# Altium project PSLink_v2.PrjPcb (part 1 of 2)
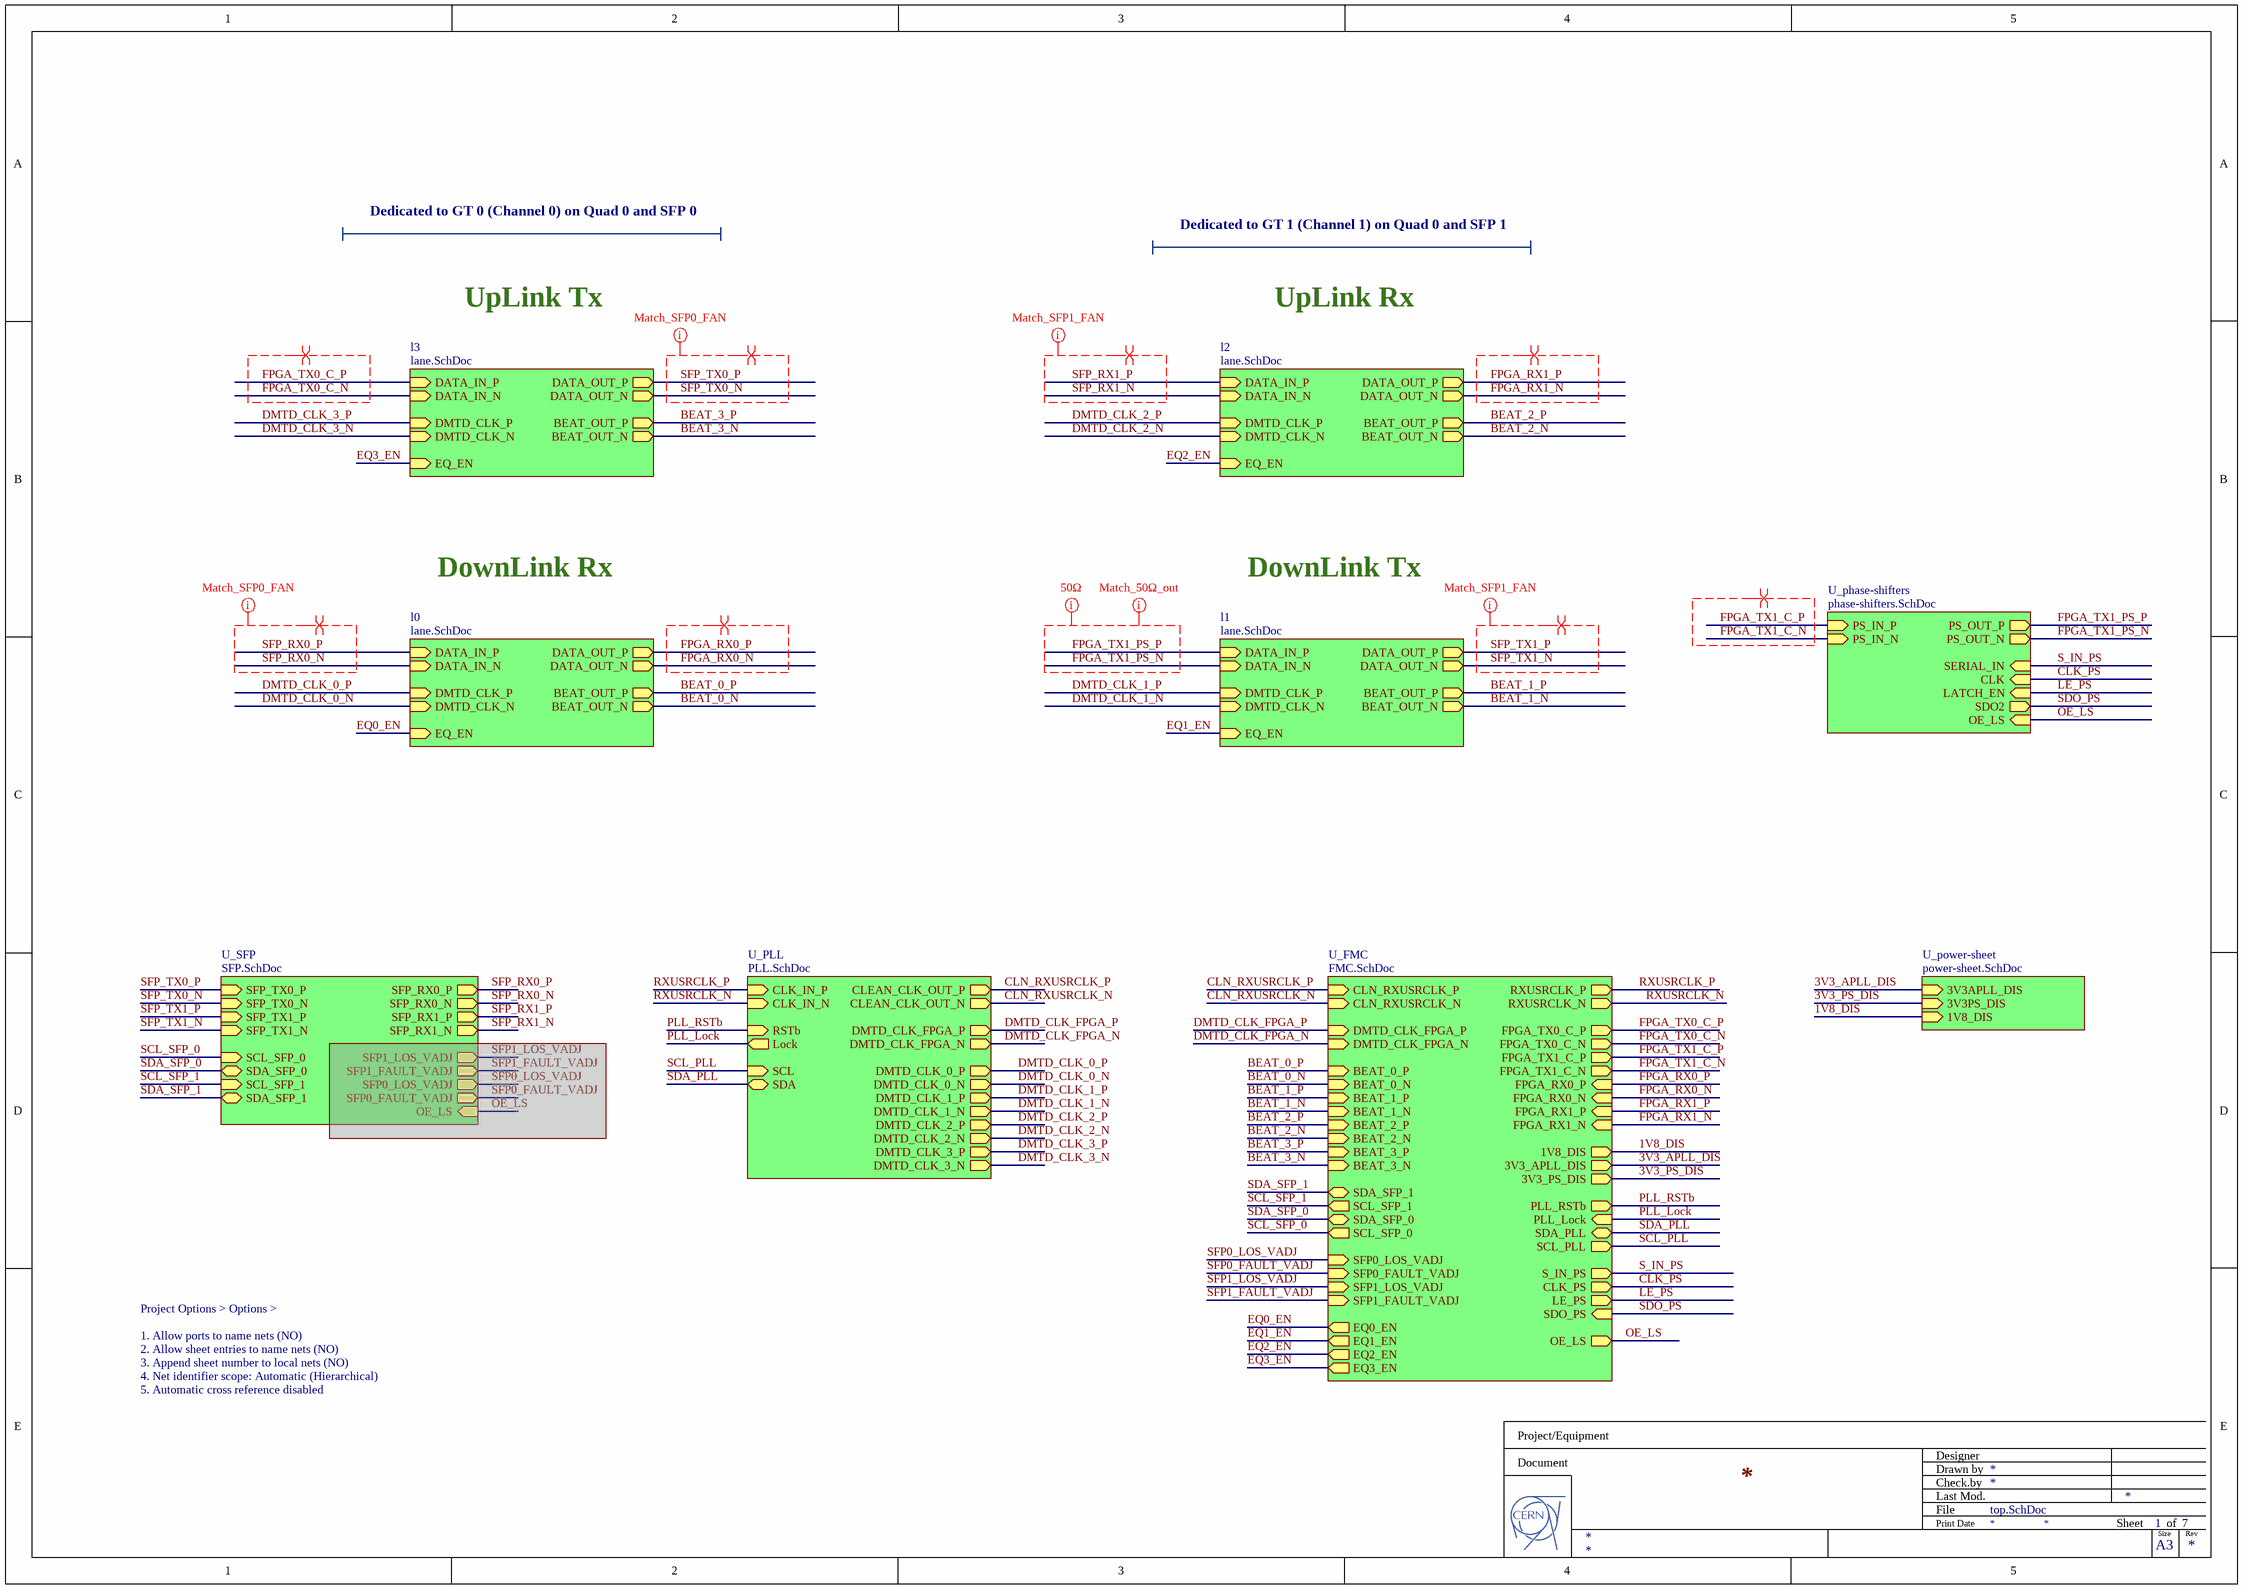
[diagram p0: top.SchDoc]
Board_Revision: 1.0
7 sheets, 294 parts. Net scope: hierarchical (ports join the sheet entries above them; power ports are global).
Board file: PCB.PcbDoc
Sheets:
  top.SchDoc
    U_SFP = SFP.SchDoc
    U_PLL = PLL.SchDoc
    l3 = lane.SchDoc
    l2 = lane.SchDoc
    l1 = lane.SchDoc
    l0 = lane.SchDoc
    U_power-sheet = power-sheet.SchDoc
    U_FMC = FMC.SchDoc
    U_phase-shifters = phase-shifters.SchDoc

## Sheet top.SchDoc
size 420 x 297 mm; SheetNumber: 1; SheetTotal: 7

### Sub-sheets
l0 = lane.SchDoc: DATA_IN_P (in), DATA_IN_N (in), BEAT_OUT_P (out), BEAT_OUT_N (out), DMTD_CLK_P (in), DMTD_CLK_N (in), DATA_OUT_P (out), DATA_OUT_N (out), EQ_EN (in)
l1 = lane.SchDoc: DATA_IN_P (in), DATA_IN_N (in), BEAT_OUT_P (out), BEAT_OUT_N (out), DMTD_CLK_P (in), DMTD_CLK_N (in), DATA_OUT_P (out), DATA_OUT_N (out), EQ_EN (in)
l2 = lane.SchDoc: DATA_IN_P (in), DATA_IN_N (in), BEAT_OUT_P (out), BEAT_OUT_N (out), DMTD_CLK_P (in), DMTD_CLK_N (in), DATA_OUT_P (out), DATA_OUT_N (out), EQ_EN (in)
l3 = lane.SchDoc: DATA_IN_P (in), DATA_IN_N (in), BEAT_OUT_P (out), BEAT_OUT_N (out), DMTD_CLK_P (in), DMTD_CLK_N (in), DATA_OUT_P (out), DATA_OUT_N (out), EQ_EN (in)
U_FMC = FMC.SchDoc: DMTD_CLK_FPGA_N (in), DMTD_CLK_FPGA_P (in), BEAT_3_P (in), BEAT_3_N (in), SCL_PLL (out), SDA_PLL (bidir), SCL_SFP_1 (out), SDA_SFP_1 (bidir), SCL_SFP_0 (out), SDA_SFP_0 (bidir), PLL_Lock (in), SFP0_LOS_VADJ (in), SFP0_FAULT_VADJ (in), SFP1_LOS_VADJ (in), SFP1_FAULT_VADJ (in), CLN_RXUSRCLK_P (in), CLN_RXUSRCLK_N (in), RXUSRCLK_P (out), RXUSRCLK_N (out), PLL_RSTb (out), 1V8_DIS (out), 3V3_APLL_DIS (out), 3V3_PS_DIS (out), FPGA_TX0_C_P (out), FPGA_TX0_C_N (out), FPGA_TX1_C_P (out), FPGA_TX1_C_N (out), FPGA_RX0_P (in), FPGA_RX0_N (in), FPGA_RX1_P (in), FPGA_RX1_N (in), BEAT_0_P (in), BEAT_0_N (in), BEAT_1_P (in), BEAT_1_N (in), BEAT_2_P (in), BEAT_2_N (in), S_IN_PS (out), CLK_PS (out), LE_PS (out), SDO_PS (in), EQ0_EN (out), EQ1_EN (out), EQ2_EN (out), EQ3_EN (out), OE_LS (out)
U_phase-shifters = phase-shifters.SchDoc: PS_IN_P (in), PS_IN_N (in), PS_OUT_P (out), LATCH_EN (in), CLK (in), SERIAL_IN (in), SDO2 (out), PS_OUT_N (out), OE_LS (in)
U_PLL = PLL.SchDoc: SCL (in), SDA (bidir), CLK_IN_P (in), CLK_IN_N (in), CLEAN_CLK_OUT_P (out), CLEAN_CLK_OUT_N (out), DMTD_CLK_0_P (out), DMTD_CLK_0_N (out), DMTD_CLK_1_P (out), DMTD_CLK_1_N (out), DMTD_CLK_2_P (out), DMTD_CLK_2_N (out), DMTD_CLK_FPGA_P (out), DMTD_CLK_FPGA_N (out), DMTD_CLK_3_P (out), DMTD_CLK_3_N (out), Lock (out), RSTb (in)
U_power-sheet = power-sheet.SchDoc: 3V3APLL_DIS (in), 3V3PS_DIS (in), 1V8_DIS (in)
U_SFP = SFP.SchDoc: SFP_RX0_P (out), SFP_RX0_N (out), SFP_TX0_P (in), SFP_TX0_N (in), SFP_RX1_P (out), SFP_RX1_N (out), SFP_TX1_P (in), SFP_TX1_N (in), SCL_SFP_0 (in), SDA_SFP_0 (bidir), SCL_SFP_1 (in), SDA_SFP_1 (bidir), SFP1_LOS_VADJ (out), SFP1_FAULT_VADJ (out), SFP0_LOS_VADJ (out), SFP0_FAULT_VADJ (out), OE_LS (in)

### Nets
1V8_DIS: sheet U_power-sheet/1V8_DIS, sheet U_FMC/1V8_DIS
3V3_APLL_DIS: sheet U_power-sheet/3V3APLL_DIS, sheet U_FMC/3V3_APLL_DIS
3V3_PS_DIS: sheet U_power-sheet/3V3PS_DIS, sheet U_FMC/3V3_PS_DIS
BEAT_0_N: sheet l0/BEAT_OUT_N, sheet U_FMC/BEAT_0_N
BEAT_0_P: sheet l0/BEAT_OUT_P, sheet U_FMC/BEAT_0_P
BEAT_1_N: sheet l1/BEAT_OUT_N, sheet U_FMC/BEAT_1_N
BEAT_1_P: sheet l1/BEAT_OUT_P, sheet U_FMC/BEAT_1_P
BEAT_2_N: sheet l2/BEAT_OUT_N, sheet U_FMC/BEAT_2_N
BEAT_2_P: sheet l2/BEAT_OUT_P, sheet U_FMC/BEAT_2_P
BEAT_3_N: sheet l3/BEAT_OUT_N, sheet U_FMC/BEAT_3_N
BEAT_3_P: sheet l3/BEAT_OUT_P, sheet U_FMC/BEAT_3_P
CLK_PS: sheet U_FMC/CLK_PS, sheet U_phase-shifters/CLK
CLN_RXUSRCLK_N: sheet U_PLL/CLEAN_CLK_OUT_N, sheet U_FMC/CLN_RXUSRCLK_N
CLN_RXUSRCLK_P: sheet U_PLL/CLEAN_CLK_OUT_P, sheet U_FMC/CLN_RXUSRCLK_P
DMTD_CLK_0_N: sheet U_PLL/DMTD_CLK_0_N, sheet l0/DMTD_CLK_N
DMTD_CLK_0_P: sheet U_PLL/DMTD_CLK_0_P, sheet l0/DMTD_CLK_P
DMTD_CLK_1_N: sheet U_PLL/DMTD_CLK_1_N, sheet l1/DMTD_CLK_N
DMTD_CLK_1_P: sheet U_PLL/DMTD_CLK_1_P, sheet l1/DMTD_CLK_P
DMTD_CLK_2_N: sheet U_PLL/DMTD_CLK_2_N, sheet l2/DMTD_CLK_N
DMTD_CLK_2_P: sheet U_PLL/DMTD_CLK_2_P, sheet l2/DMTD_CLK_P
DMTD_CLK_3_N: sheet U_PLL/DMTD_CLK_3_N, sheet l3/DMTD_CLK_N
DMTD_CLK_3_P: sheet U_PLL/DMTD_CLK_3_P, sheet l3/DMTD_CLK_P
DMTD_CLK_FPGA_N: sheet U_PLL/DMTD_CLK_FPGA_N, sheet U_FMC/DMTD_CLK_FPGA_N
DMTD_CLK_FPGA_P: sheet U_PLL/DMTD_CLK_FPGA_P, sheet U_FMC/DMTD_CLK_FPGA_P
EQ0_EN: sheet l0/EQ_EN, sheet U_FMC/EQ0_EN
EQ1_EN: sheet l1/EQ_EN, sheet U_FMC/EQ1_EN
EQ2_EN: sheet l2/EQ_EN, sheet U_FMC/EQ2_EN
EQ3_EN: sheet l3/EQ_EN, sheet U_FMC/EQ3_EN
FPGA_RX0_N: sheet l0/DATA_OUT_N, sheet U_FMC/FPGA_RX0_N
FPGA_RX0_P: sheet l0/DATA_OUT_P, sheet U_FMC/FPGA_RX0_P
FPGA_RX1_N: sheet l2/DATA_OUT_N, sheet U_FMC/FPGA_RX1_N
FPGA_RX1_P: sheet l2/DATA_OUT_P, sheet U_FMC/FPGA_RX1_P
FPGA_TX0_C_N: sheet l3/DATA_IN_N, sheet U_FMC/FPGA_TX0_C_N
FPGA_TX0_C_P: sheet l3/DATA_IN_P, sheet U_FMC/FPGA_TX0_C_P
FPGA_TX1_C_N: sheet U_FMC/FPGA_TX1_C_N, sheet U_phase-shifters/PS_IN_N
FPGA_TX1_C_P: sheet U_FMC/FPGA_TX1_C_P, sheet U_phase-shifters/PS_IN_P
FPGA_TX1_PS_N: sheet l1/DATA_IN_N, sheet U_phase-shifters/PS_OUT_N
FPGA_TX1_PS_P: sheet l1/DATA_IN_P, sheet U_phase-shifters/PS_OUT_P
LE_PS: sheet U_FMC/LE_PS, sheet U_phase-shifters/LATCH_EN
OE_LS: sheet U_FMC/OE_LS, sheet U_phase-shifters/OE_LS
PLL_Lock: sheet U_PLL/Lock, sheet U_FMC/PLL_Lock
PLL_RSTb: sheet U_PLL/RSTb, sheet U_FMC/PLL_RSTb
RXUSRCLK_N: sheet U_PLL/CLK_IN_N, sheet U_FMC/RXUSRCLK_N
RXUSRCLK_P: sheet U_PLL/CLK_IN_P, sheet U_FMC/RXUSRCLK_P
S_IN_PS: sheet U_FMC/S_IN_PS, sheet U_phase-shifters/SERIAL_IN
SCL_PLL: sheet U_PLL/SCL, sheet U_FMC/SCL_PLL  [project net ADJ_SCL]
SCL_SFP_0: sheet U_SFP/SCL_SFP_0, sheet U_FMC/SCL_SFP_0  [project net SCL0]
SCL_SFP_1: sheet U_SFP/SCL_SFP_1, sheet U_FMC/SCL_SFP_1  [project net SCL1]
SDA_PLL: sheet U_PLL/SDA, sheet U_FMC/SDA_PLL  [project net ADJ_SDA]
SDA_SFP_0: sheet U_SFP/SDA_SFP_0, sheet U_FMC/SDA_SFP_0  [project net SDA0]
SDA_SFP_1: sheet U_SFP/SDA_SFP_1, sheet U_FMC/SDA_SFP_1  [project net SDA1]
SDO_PS: sheet U_FMC/SDO_PS, sheet U_phase-shifters/SDO2
SFP0_FAULT_VADJ: sheet U_FMC/SFP0_FAULT_VADJ
SFP0_LOS_VADJ: sheet U_FMC/SFP0_LOS_VADJ
SFP1_FAULT_VADJ: sheet U_FMC/SFP1_FAULT_VADJ
SFP1_LOS_VADJ: sheet U_FMC/SFP1_LOS_VADJ
SFP_RX0_N: sheet U_SFP/SFP_RX0_N, sheet l0/DATA_IN_N
SFP_RX0_P: sheet U_SFP/SFP_RX0_P, sheet l0/DATA_IN_P
SFP_RX1_N: sheet U_SFP/SFP_RX1_N, sheet l2/DATA_IN_N
SFP_RX1_P: sheet U_SFP/SFP_RX1_P, sheet l2/DATA_IN_P
SFP_TX0_N: sheet U_SFP/SFP_TX0_N, sheet l3/DATA_OUT_N
SFP_TX0_P: sheet U_SFP/SFP_TX0_P, sheet l3/DATA_OUT_P
SFP_TX1_N: sheet U_SFP/SFP_TX1_N, sheet l1/DATA_OUT_N
SFP_TX1_P: sheet U_SFP/SFP_TX1_P, sheet l1/DATA_OUT_P

### Layout directives
differential pair: FPGA_RX0_N, FPGA_RX0_P, FPGA_RX1_N, FPGA_RX1_P, FPGA_TX0_C_N, FPGA_TX0_C_P, FPGA_TX1_C_N, FPGA_TX1_C_P, SFP_RX0_N, SFP_RX0_P, SFP_RX1_N, SFP_RX1_P, SFP_TX0_N, SFP_TX0_P, SFP_TX1_N, SFP_TX1_P
net class Match_SFP0_FAN: SFP_RX0_N, SFP_RX0_P, SFP_TX0_N, SFP_TX0_P
net class Match_SFP1_FAN: SFP_RX1_N, SFP_RX1_P, SFP_TX1_N, SFP_TX1_P
net class Match_50ohm_out: FPGA_TX1_PS_N, FPGA_TX1_PS_P
net class 50ohm: FPGA_TX1_PS_N, FPGA_TX1_PS_P

### Notes on the sheet
- Dedicated to GT 0 (Channel 0) on Quad 0 and SFP 0
- Dedicated to GT 1 (Channel 1) on Quad 0 and SFP 1
- UpLink Tx
- UpLink Rx
- DownLink Rx
- DownLink Tx
- Project Options > Options >
  1. Allow ports to name nets (NO)
  2. Allow sheet entries to name nets (NO)
  3. Append sheet number to local nets (NO)
  4. Net identifier scope: Automatic (Hierarchical)
  5. Automatic cross reference disabled
- Project/Equipment
- Document
- Designer
- Drawn by
- Check.by
- File
- Last Mod.
- Print Date
- Sheet
- Size
- A3
- of
- Rev

## Sheet SFP.SchDoc
size 420 x 297 mm; SheetNumber: 3; SheetTotal: 7
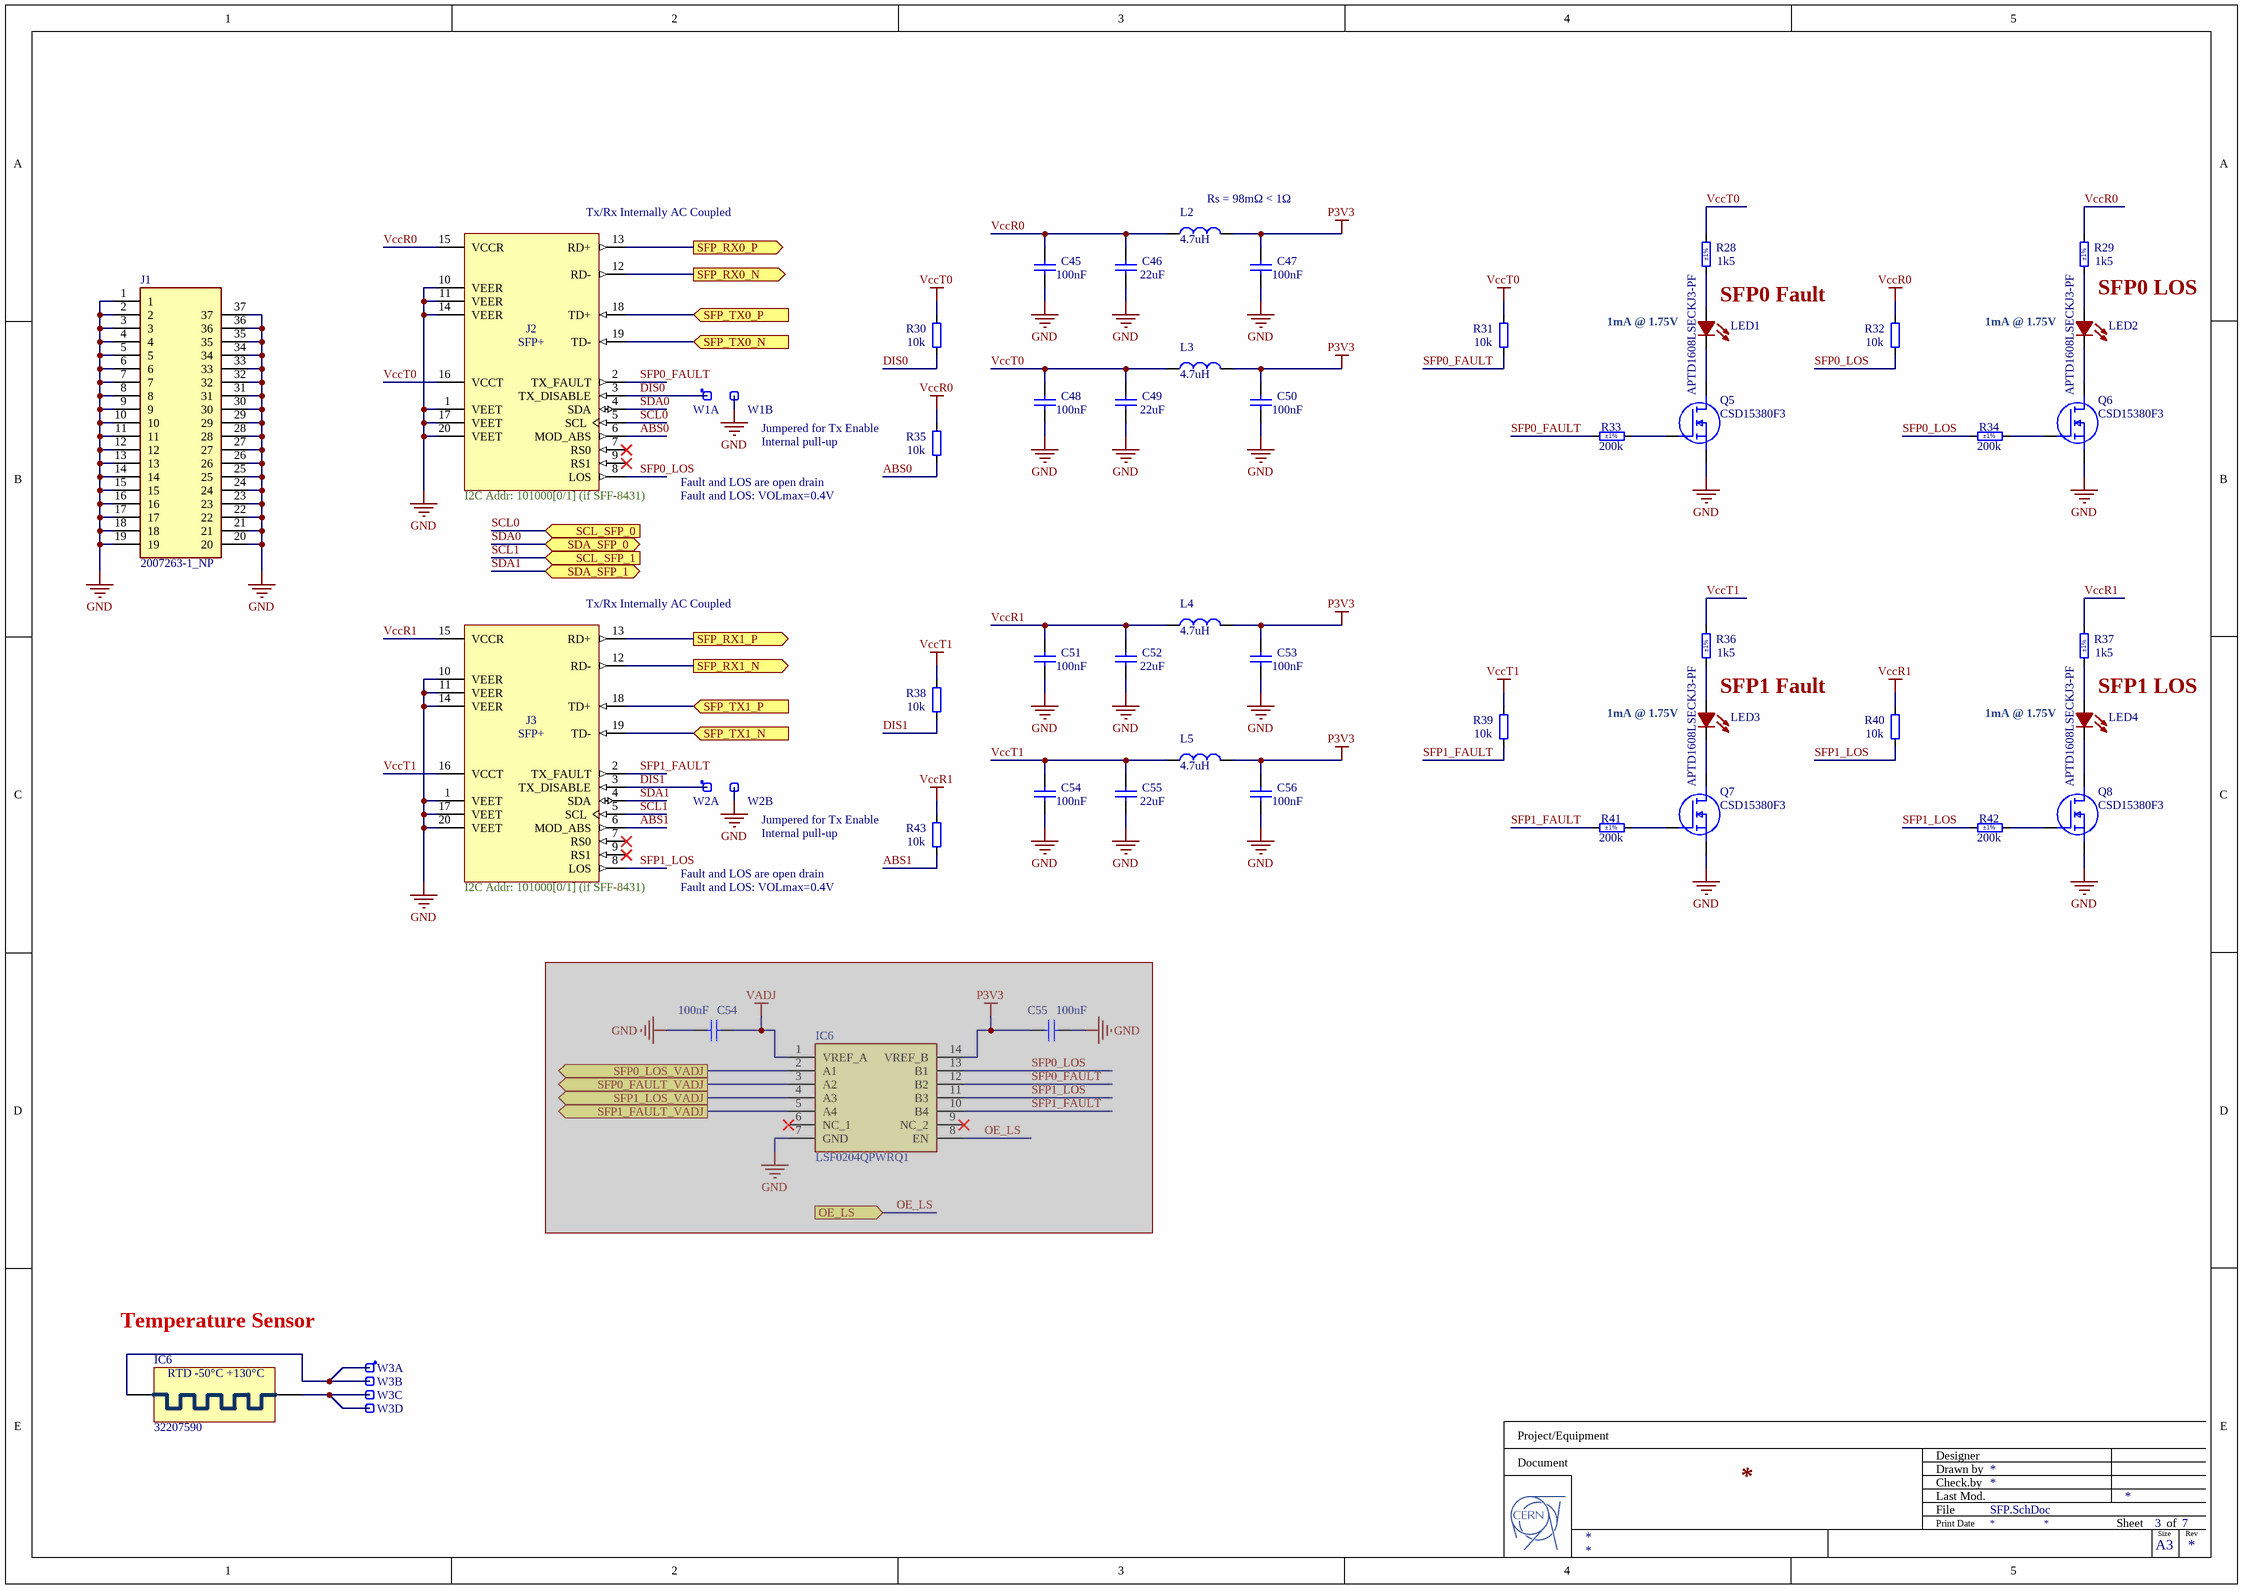
[diagram p1: SFP.SchDoc]

### Parts
(Parts that share a designator on the sheet are numbered #1, #2 ... from top to bottom, then left to right.)
C45  100nF  [MURATA_HI_DENSITY_0201]
C46  22uF  [MURATA_HI_DENSITY_0402_CAP]
C47  100nF  [MURATA_HI_DENSITY_0201]
C48  100nF  [MURATA_HI_DENSITY_0201]
C49  22uF  [MURATA_HI_DENSITY_0402_CAP]
C50  100nF  [MURATA_HI_DENSITY_0201]
C51  100nF  [MURATA_HI_DENSITY_0201]
C52  22uF  [MURATA_HI_DENSITY_0402_CAP]
C53  100nF  [MURATA_HI_DENSITY_0201]
C54#1  100nF  [MURATA_HI_DENSITY_0201]
C54#2  100nF  [MURATA_HI_DENSITY_0201]  (masked out: inside a compile mask, not in the netlist)
C55#1  22uF  [MURATA_HI_DENSITY_0402_CAP]
C55#2  100nF  [MURATA_HI_DENSITY_0201]  (masked out: inside a compile mask, not in the netlist)
C56  100nF  [MURATA_HI_DENSITY_0201]
IC6#1  LSF0204QPWRQ1  [SOP65P640X120-14N]  (masked out: inside a compile mask, not in the netlist)
IC6#2  32207590  [PT100]
J1  2007263-1_NP  [20072631_NP]
J2  SFP+  [TYCO_1888247-1]
J3  SFP+  [TYCO_1888247-1]
L2  4.7uH  [DFE322520FD1R0MP2]
L3  4.7uH  [DFE322520FD1R0MP2]
L4  4.7uH  [DFE322520FD1R0MP2]
L5  4.7uH  [DFE322520FD1R0MP2]
LED1  APTD1608LSECKJ3-PF  [LED_APTD1608LSECKJ3-PF_KNB]
LED2  APTD1608LSECKJ3-PF  [LED_APTD1608LSECKJ3-PF_KNB]
LED3  APTD1608LSECKJ3-PF  [LED_APTD1608LSECKJ3-PF_KNB]
LED4  APTD1608LSECKJ3-PF  [LED_APTD1608LSECKJ3-PF_KNB]
Q5  CSD15380F3  [CSD15380F3]
Q6  CSD15380F3  [CSD15380F3]
Q7  CSD15380F3  [CSD15380F3]
Q8  CSD15380F3  [CSD15380F3]
R28  1k5  Tolerance: ±1%  [RESC1005X40N]
R29  1k5  Tolerance: ±1%  [RESC1005X40N]
R30  10k  [MURATA_HI_DENSITY_0201]
R31  10k  [MURATA_HI_DENSITY_0201]
R32  10k  [MURATA_HI_DENSITY_0201]
R33  200k  Tolerance: ±1%  [RESC1005X40N]
R34  200k  Tolerance: ±1%  [RESC1005X40N]
R35  10k  [MURATA_HI_DENSITY_0201]
R36  1k5  Tolerance: ±1%  [RESC1005X40N]
R37  1k5  Tolerance: ±1%  [RESC1005X40N]
R38  10k  [MURATA_HI_DENSITY_0201]
R39  10k  [MURATA_HI_DENSITY_0201]
R40  10k  [MURATA_HI_DENSITY_0201]
R41  200k  Tolerance: ±1%  [RESC1005X40N]
R42  200k  Tolerance: ±1%  [RESC1005X40N]
R43  10k  [MURATA_HI_DENSITY_0201]
W1  Header 2  [SAMTEC_HTSW-102-23-L-S]  (value not drawn)  (parts A,B of 2)
W2  Header 2  [SAMTEC_HTSW-102-23-L-S]  (value not drawn)  (parts A,B of 2)
W3  Header 4  [SAMTEC_HTSW-104-23-L-S]  (value not drawn)  (parts A,B,C,D of 4)

### Ports
OE_LS (in), SCL_SFP_0 (in), SCL_SFP_1 (in), SDA_SFP_0 (bidir), SDA_SFP_1 (bidir), SFP0_FAULT_VADJ (out), SFP0_LOS_VADJ (out), SFP1_FAULT_VADJ (out), SFP1_LOS_VADJ (out), SFP_RX0_N (out), SFP_RX0_P (out), SFP_RX1_N (out), SFP_RX1_P (out), SFP_TX0_N (in), SFP_TX0_P (in), SFP_TX1_N (in), SFP_TX1_P (in)

### Nets
GND: C45.1 C46.1 C47.1 C48.1 C49.1 C50.1 C51.1 C52.1 C53.1 C54#1.1 C55#1.1 C56.1 J1.1 J1.2 J1.3 J1.4 J1.5 J1.6 J1.7 J1.8 J1.9 J1.10 J1.11 J1.12 J1.13 J1.14 J1.15 J1.16 J1.17 J1.18 J1.19 J1.20 J1.21 J1.22 J1.23 J1.24 J1.25 J1.26 J1.27 J1.28 J1.29 J1.30 J1.31 J1.32 J1.33 J1.34 J1.35 J1.36 J1.37 J2.1(VEET) J2.10(VEER) J2.11(VEER) J2.14(VEER) J2.17(VEET) J2.20(VEET) J3.1(VEET) J3.10(VEER) J3.11(VEER) J3.14(VEER) J3.17(VEET) J3.20(VEET) Q5.2(S) Q6.2(S) Q7.2(S) Q8.2(S) W1.2 W2.2
P3V3: C47.2 C50.2 C53.2 C56.2 L2.2 L3.2 L4.2 L5.2
VccR0: C45.2 C46.2 J2.15(VCCR) L2.1 R29.2 R32.2 R35.2
VccR1: C51.2 C52.2 J3.15(VCCR) L4.1 R37.2 R40.2 R43.2
VccT0: C48.2 C49.2 J2.16(VCCT) L3.1 R28.2 R30.2 R31.2
VccT1: C54#1.2 C55#1.2 J3.16(VCCT) L5.1 R36.2 R38.2 R39.2
ABS0: J2.6(MOD_ABS) R35.1
ABS1: J3.6(MOD_ABS) R43.1
DIS0: J2.3(TX_DISABLE) R30.1 W1.1
DIS1: J3.3(TX_DISABLE) R38.1 W2.1
SCL0: J2.5(SCL) ; port SCL_SFP_0
SCL1: J3.5(SCL) ; port SCL_SFP_1
SDA0: J2.4(SDA) ; port SDA_SFP_0
SDA1: J3.4(SDA) ; port SDA_SFP_1
SFP0_FAULT: J2.2(TX_FAULT) R31.1 R33.1
SFP0_LOS: J2.8(LOS) R32.1 R34.1
SFP1_FAULT: J3.2(TX_FAULT) R39.1 R41.1
SFP1_LOS: J3.8(LOS) R40.1 R42.1
SFP_RX0_N: J2.12(RD-) ; port SFP_RX0_N
SFP_RX0_P: J2.13(RD+) ; port SFP_RX0_P
SFP_RX1_N: J3.12(RD-) ; port SFP_RX1_N
SFP_RX1_P: J3.13(RD+) ; port SFP_RX1_P
SFP_TX0_N: J2.19(TD-) ; port SFP_TX0_N
SFP_TX0_P: J2.18(TD+) ; port SFP_TX0_P
SFP_TX1_N: J3.19(TD-) ; port SFP_TX1_N
SFP_TX1_P: J3.18(TD+) ; port SFP_TX1_P
NetIC6#2_1: IC6#2.1 W3.1 W3.2
NetIC6#2_2: IC6#2.2 W3.3 W3.4
NetLED1_1: LED1.1(C) Q5.3(D)
NetLED1_2: LED1.2(A) R28.1
NetLED2_1: LED2.1(C) Q6.3(D)
NetLED2_2: LED2.2(A) R29.1
NetLED3_1: LED3.1(C) Q7.3(D)
NetLED3_2: LED3.2(A) R36.1
NetLED4_1: LED4.1(C) Q8.3(D)
NetLED4_2: LED4.2(A) R37.1
NetQ5_1: Q5.1(G) R33.2
NetQ6_1: Q6.1(G) R34.2
NetQ7_1: Q7.1(G) R41.2
NetQ8_1: Q8.1(G) R42.2

Not connected (* = marked no-connect by the designer): J2 7(RS0)* 9(RS1)*; J3 7(RS0)* 9(RS1)*

### Notes on the sheet
- (near J2) Tx/Rx Internally AC Coupled
- (near L2) Rs = 98mΩ < 1Ω
- (near LED1) 1mA @ 1.75V
- SFP0 Fault
- (near LED2) 1mA @ 1.75V
- SFP0 LOS
- Jumpered for Tx Enable
- (near W1) Internal pull-up
- (near J2) I2C Addr: 101000[0/1] (if SFF-8431)
- Fault and LOS are open drain
- Fault and LOS: VOLmax=0.4V
- (near J3) Tx/Rx Internally AC Coupled
- (near LED3) 1mA @ 1.75V
- SFP1 Fault
- (near LED4) 1mA @ 1.75V
- SFP1 LOS
- (near W2) Internal pull-up
- (near J3) I2C Addr: 101000[0/1] (if SFF-8431)
- Temperature Sensor
- Project/Equipment
- Document
- Designer
- Drawn by
- Check.by
- File
- Last Mod.
- Print Date
- Sheet
- Size
- A3
- of
- Rev
- (in symbol PT100) RTD; -50°C +130°C

### Library data of the parts
C45 C47 C48 C50 C51 C53 C54#1 C54#2 C55#2 C56 = C0201-100nF-high-density: GRM033R61C104KE14; Vmax: 16V; Value: 100nF
C46 C49 C52 C55#1 = C0402-22uF-high-density: GRM155R60J226ME11; Vmax: 6.3V; Value: 22uF
IC6#1 = LSF0204QPWRQ1: Integrated Circuit; Manufacturer_Name: Texas Instruments; Datasheet Link: http://www.ti.com/lit/gpn/lsf0204-q1; Height: 1.2mm; Manufacturer_Part_Number: LSF0204QPWRQ1; Mouser Part Number: 595-LSF0204QPWRQ1; Mouser Price/Stock: https://www.mouser.co.uk/ProductDetail/Texas-Instruments/LSF0204QPWRQ1?qs=w%2Fv1CP2dgqqt88p%2F1xId1A%3D%3D; Arrow Part Number: LSF0204QPWRQ1; Arrow Price/Stock: https://www.arrow.com/en/products/lsf0204qpwrq1/texas-instruments?region=nac
IC6#2 = PT100: 32207590 - PT100 - 1206 - 0.3degC - -50/130
J1 = 2007263-1_NP: Connector; Manufacturer_Name: TE Connectivity; Datasheet Link: https://www.te.com/commerce/DocumentDelivery/DDEController?Action=srchrtrv&DocNm=4-1773455-3_Quick_Ref_Guide_SFP%2B_Sol&DocType=Data%20Sheet&DocLang=English&PartCntxt=2007263-1&DocFormat=pdf; Height: 9.8mm; Manufacturer_Part_Number: 2007263-1; Mouser Part Number: 571-2007263-1; Mouser Price/Stock: https://www.mouser.co.uk/ProductDetail/TE-Connectivity/2007263-1?qs=4zF2lffhceF8GItBX4M8mw%3D%3D; Arrow Part Number: 2007263-1; Arrow Price/Stock: https://www.arrow.com/en/products/2007263-1/te-connectivity?region=europe
J2 J3 = TYCO_1888247-1: 20 Position SFP+ Connector (Small Form-factor Pluggable); Part Description: 20 Position, Pitch 0.8mm SFP+ Receptacle (Small Form-factor Pluggable); Manufacturer: TYCO ELECTRONICS; PressFit: No; Part Number: TYCO_1888247-1; Component Kind: Standard; Component Type: Standard; Pin Count: 20; Family: SFP+; Mounted: Yes; Socket: No; SMD: Yes; Sense: No; Status: None; Manufacturer Part Number: 1888247-1; ComponentHeight: 5.4mm; HelpURL: \\cern.ch\dfs\Applications\Altium\Datasheets\TYCO_1888247-1.pdf; Author: CERN DEM JLC; CreateDate: 2/27/2012; LatestRevisionDate: 2/27/2012
L2-L5 = DFE322520FD-4R7M=P2: Inductor; Manufacturer_Name: Murata Electronics; Datasheet Link: https://search.murata.co.jp/Ceramy/image/img/P02/J(E)TE243A-9104.pdf; Height: 2mm; Manufacturer_Part_Number: DFE322520FD-4R7M=P2; Mouser Part Number: 81-DFE322520FD4R7MP2; Mouser Price/Stock: https://www.mouser.co.uk/ProductDetail/Murata-Electronics/DFE322520FD-4R7M%3dP2?qs=17u8i%2FzlE8%252BgAY54mivQ1g%3D%3D; Arrow Part Number: DFE322520FD-4R7M=P2; Arrow Price/Stock: https://www.arrow.com/en/products/dfe322520fd-4r7mp2/murata-manufacturing?region=nac
LED1-LED4 = APTD1608LSECKJ3-PF: Led Red 0603 2mA 1.8V 50mcd 84mW; Mfr_Name: Kingbright
Q5-Q8 = CSD15380F3: MOSFET (N-Channel); Manufacturer_Name: Texas Instruments; Datasheet Link: https://www.ti.com/lit/ds/symlink/csd15380f3.pdf?ts=1641221366106&ref_url=https%253A%252F%252Fwww.google.com%252F; Height: 0.35mm; Manufacturer_Part_Number: CSD15380F3; Mouser Part Number: 595-CSD15380F3; Mouser Price/Stock: https://www.mouser.co.uk/ProductDetail/Texas-Instruments/CSD15380F3?qs=zEmsApcVOkXP46xhm0edmA%3D%3D; Arrow Part Number: CSD15380F3; Arrow Price/Stock: https://www.arrow.com/en/products/csd15380f3/texas-instruments?region=nac
R28 R29 R36 R37 = R0402_1K5_1%_0.0625W_100PPM: Resistor - 1%; Part Description: General Purpose Thick Film Chip Resistor; Manufacturer: GENERIC; Manufacturer1 Part Number: 232270671502L; TC: ±100ppm/°C; PressFit: No; Part Number: R0402_1K5_1%_0.0625W_100PPM; Component Kind: Standard; Component Type: Standard; Pin Count: 2; Value: 1k5; Status: Not Recommended; Power: 0.0625W; Manufacturer Part Number: R0402_1K5_1%_0.0625W_100PPM; Case: 0402; Mounted: Yes; Sense: No; Socket: No; SMD: Yes; Manufacturer1 Example: YAGEO PHYCOMP; Manufacturer1 ComponentHeight: 0.4mm; HelpURL: \\cern.ch\dfs\Applications\Altium\Datasheets\R0402_Phycomp_RC0402.pdf; Author: CERN DEM JLC; CreateDate: 12/3/2007; LatestRevisionDate: 10/17/2012
R30-R32 R35 R38-R40 R43 = R0201-100ohm-high-density: Resistor 10k; Value: 100Ω
R33 R34 R41 R42 = R0402_200K_1%_0.0625W_100PPM: Resistor - 1%; Part Description: General Purpose Thick Film Chip Resistor; Manufacturer: GENERIC; Manufacturer1 Part Number: 232270672004L; TC: ±100ppm/°C; PressFit: No; Part Number: R0402_200K_1%_0.0625W_100PPM; Component Kind: Standard; Component Type: Standard; Pin Count: 2; Value: 200k; Status: Not Recommended; Power: 0.0625W; Manufacturer Part Number: R0402_200K_1%_0.0625W_100PPM; Case: 0402; Mounted: Yes; Sense: No; Socket: No; SMD: Yes; Manufacturer1 Example: YAGEO PHYCOMP; Manufacturer1 ComponentHeight: 0.4mm; HelpURL: \\cern.ch\dfs\Applications\Altium\Datasheets\R0402_Phycomp_RC0402.pdf; Author: CERN DEM JLC; CreateDate: 12/3/2007; LatestRevisionDate: 10/17/2012
W1 W2 = SAMTEC_HTSW-102-23-L-S: 2 Mini Wire-Wrap Contact Strip Header; Part Description: 2 Contacts, Pitch 2.54mm, Single Row  Through Mount Straight Header (Post Lead 5.84mm, Tail Lead 2.92mm, Insulator 2.54mm); Manufacturer: SAMTEC; PressFit: No; Status Comment: High Temperature; Part Number: SAMTEC_HTSW-102-23-L-S; Component Kind: Standard; Component Type: Standard; Pin Count: 2; Family: Header 2; Mounted: Yes; Socket: No; SMD: No; Sense: No; Status: Preferred; Manufacturer Part Number: HTSW-102-23-L-S; ComponentHeight: 8.38mm; HelpURL: \\cern.ch\dfs\Applications\Altium\Datasheets\SAMTEC_HTSW-102-23-L-S.pdf; Author: CERN DEM JLC; CreateDate: 2/22/2018; LatestRevisionDate: 2/22/2018
W3 = SAMTEC_HTSW-104-23-L-S: 4 Mini Wire-Wrap Contact Strip Header; Part Description: 4 Contacts, Pitch 2.54mm, Single Row  Through Mount Straight Header (Post Lead 5.84mm, Tail Lead 2.92mm, Insulator 2.54mm); Manufacturer: SAMTEC; PressFit: No; Status Comment: High Temperature; Part Number: SAMTEC_HTSW-104-23-L-S; Component Kind: Standard; Component Type: Standard; Pin Count: 4; Family: Header 4; Mounted: Yes; Socket: No; SMD: No; Sense: No; Status: Preferred; Manufacturer Part Number: HTSW-104-23-L-S; ComponentHeight: 8.38mm; HelpURL: \\cern.ch\dfs\Applications\Altium\Datasheets\SAMTEC_HTSW-104-23-L-S.pdf; Author: CERN DEM JLC; CreateDate: 2/22/2018; LatestRevisionDate: 2/22/2018

## Sheet PLL.SchDoc
size 420 x 297 mm; SheetNumber: 5; SheetTotal: 7
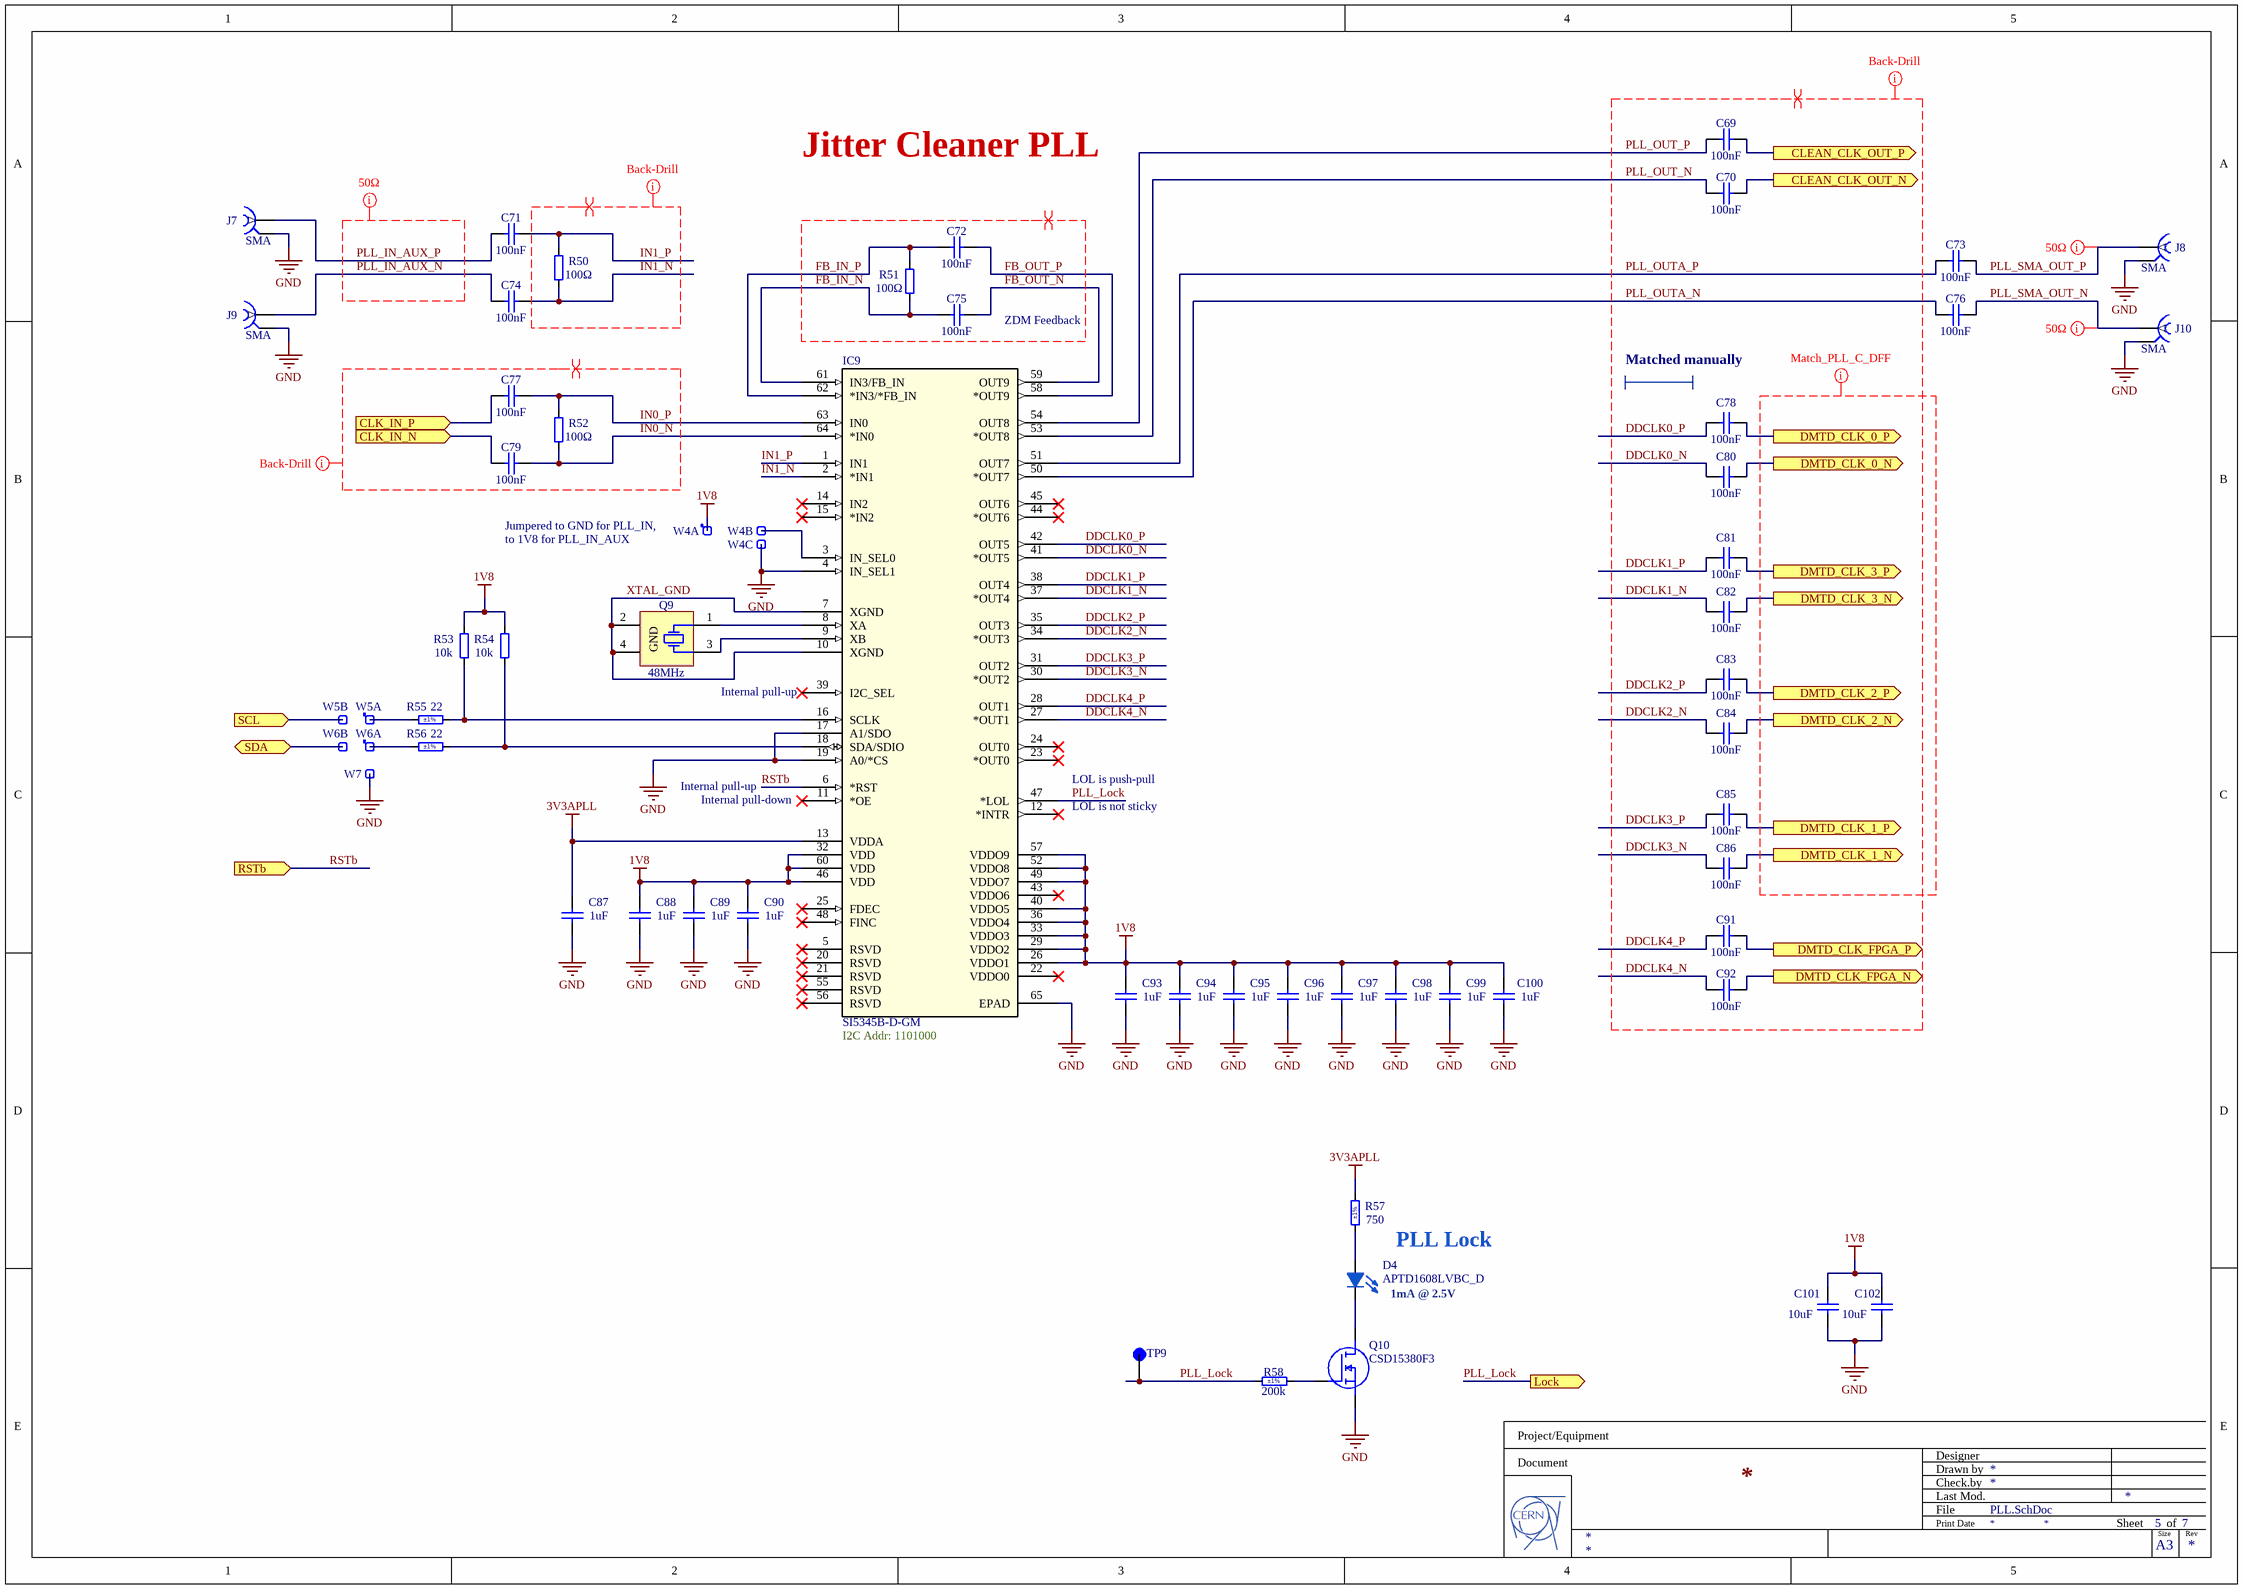
[diagram p2: PLL.SchDoc]

### Parts
C69  100nF  [MURATA_HI_DENSITY_0201]
C70  100nF  [MURATA_HI_DENSITY_0201]
C71  100nF  [MURATA_HI_DENSITY_0201]
C72  100nF  [MURATA_HI_DENSITY_0201]
C73  100nF  [MURATA_HI_DENSITY_0201]
C74  100nF  [MURATA_HI_DENSITY_0201]
C75  100nF  [MURATA_HI_DENSITY_0201]
C76  100nF  [MURATA_HI_DENSITY_0201]
C77  100nF  [MURATA_HI_DENSITY_0201]
C78  100nF  [MURATA_HI_DENSITY_0201]
C79  100nF  [MURATA_HI_DENSITY_0201]
C80  100nF  [MURATA_HI_DENSITY_0201]
C81  100nF  [MURATA_HI_DENSITY_0201]
C82  100nF  [MURATA_HI_DENSITY_0201]
C83  100nF  [MURATA_HI_DENSITY_0201]
C84  100nF  [MURATA_HI_DENSITY_0201]
C85  100nF  [MURATA_HI_DENSITY_0201]
C86  100nF  [MURATA_HI_DENSITY_0201]
C87  1uF  [CAPC1005X55N]
C88  1uF  [CAPC1005X55N]
C89  1uF  [CAPC1005X55N]
C90  1uF  [CAPC1005X55N]
C91  100nF  [MURATA_HI_DENSITY_0201]
C92  100nF  [MURATA_HI_DENSITY_0201]
C93  1uF  [CAPC1005X55N]
C94  1uF  [CAPC1005X55N]
C95  1uF  [CAPC1005X55N]
C96  1uF  [CAPC1005X55N]
C97  1uF  [CAPC1005X55N]
C98  1uF  [CAPC1005X55N]
C99  1uF  [CAPC1005X55N]
C100  1uF  [CAPC1005X55N]
C101  10uF  [CAPC1608X87N]
C102  10uF  [CAPC1608X87N]
D4  APTD1608LVBC_D  [LEDC1608X110N]
IC9  SI5345B-D-GM  [QFN50P900X900X90-65N-D]
J7  SMA  [SAMTEC_SMA-J-P-H-ST-MT1]
J8  SMA  [SAMTEC_SMA-J-P-H-ST-MT1]
J9  SMA  [SAMTEC_SMA-J-P-H-ST-MT1]
J10  SMA  [SAMTEC_SMA-J-P-H-ST-MT1]
Q9  48MHz  [XTAL_KYOCERA_CX3225SB]
Q10  CSD15380F3  [CSD15380F3]
R50  100Ω  [MURATA_HI_DENSITY_0201]
R51  100Ω  [MURATA_HI_DENSITY_0201]
R52  100Ω  [MURATA_HI_DENSITY_0201]
R53  10k  [MURATA_HI_DENSITY_0201]
R54  10k  [MURATA_HI_DENSITY_0201]
R55  22  Tolerance: ±1%  [RESC1005X40N]
R56  22  Tolerance: ±1%  [RESC1005X40N]
R57  750  Tolerance: ±1%  [RESC1005X40N]
R58  200k  Tolerance: ±1%  [RESC1005X40N]
TP9  RCU-0C  [TP+195X110]  (value not drawn)
W4  Header 3  [SAMTEC_HTSW-103-23-L-S]  (value not drawn)  (parts A,B,C of 3)
W5  Header 2  [SAMTEC_HTSW-102-23-L-S]  (value not drawn)  (parts A,B of 2)
W6  Header 2  [SAMTEC_HTSW-102-23-L-S]  (value not drawn)  (parts A,B of 2)
W7  Header 1  [SAMTEC_HTSW-101-23-L-S]  (value not drawn)

### Ports
CLEAN_CLK_OUT_N (out), CLEAN_CLK_OUT_P (out), CLK_IN_N (in), CLK_IN_P (in), DMTD_CLK_0_N (out), DMTD_CLK_0_P (out), DMTD_CLK_1_N (out), DMTD_CLK_1_P (out), DMTD_CLK_2_N (out), DMTD_CLK_2_P (out), DMTD_CLK_3_N (out), DMTD_CLK_3_P (out), DMTD_CLK_FPGA_N (out), DMTD_CLK_FPGA_P (out), Lock (out), RSTb (in), SCL (in), SDA (bidir)

### Nets
1V8: C88.2 C89.2 C90.2 C93.2 C94.2 C95.2 C96.2 C97.2 C98.2 C99.2 C100.2 C101.2 C102.2 IC9.26(VDDO1) IC9.29(VDDO2) IC9.32(VDD) IC9.33(VDDO3) IC9.36(VDDO4) IC9.40(VDDO5) IC9.46(VDD) IC9.49(VDDO7) IC9.52(VDDO8) IC9.57(VDDO9) IC9.60(VDD) R53.2 R54.2 W4.1
3V3APLL: C87.2 IC9.13(VDDA) R57.2
GND: C87.1 C88.1 C89.1 C90.1 C93.1 C94.1 C95.1 C96.1 C97.1 C98.1 C99.1 C100.1 C101.1 C102.1 IC9.4(IN_SEL1) IC9.17(A1/SDO) IC9.19(A0/*CS) IC9.65(EPAD) J7.2 J8.2 J9.2 J10.2 Q10.2(S) W4.3 W7.1
ADJ_SCL: W5.2 ; port SCL
ADJ_SDA: W6.2 ; port SDA
CLN_RXUSRCLK_N: C70.2 ; port CLEAN_CLK_OUT_N
CLN_RXUSRCLK_P: C69.2 ; port CLEAN_CLK_OUT_P
DDCLK0_N: C80.1 IC9.41(*OUT5)
DDCLK0_P: C78.1 IC9.42(OUT5)
DDCLK1_N: C82.1 IC9.37(*OUT4)
DDCLK1_P: C81.1 IC9.38(OUT4)
DDCLK2_N: C84.1 IC9.34(*OUT3)
DDCLK2_P: C83.1 IC9.35(OUT3)
DDCLK3_N: C86.1 IC9.30(*OUT2)
DDCLK3_P: C85.1 IC9.31(OUT2)
DDCLK4_N: C92.1 IC9.27(*OUT1)
DDCLK4_P: C91.1 IC9.28(OUT1)
DMTD_CLK_0_N: C80.2 ; port DMTD_CLK_0_N
DMTD_CLK_0_P: C78.2 ; port DMTD_CLK_0_P
DMTD_CLK_1_N: C86.2 ; port DMTD_CLK_1_N
DMTD_CLK_1_P: C85.2 ; port DMTD_CLK_1_P
DMTD_CLK_2_N: C84.2 ; port DMTD_CLK_2_N
DMTD_CLK_2_P: C83.2 ; port DMTD_CLK_2_P
DMTD_CLK_3_N: C82.2 ; port DMTD_CLK_3_N
DMTD_CLK_3_P: C81.2 ; port DMTD_CLK_3_P
DMTD_CLK_FPGA_N: C92.2 ; port DMTD_CLK_FPGA_N
DMTD_CLK_FPGA_P: C91.2 ; port DMTD_CLK_FPGA_P
FB_IN_N: C75.1 IC9.61(IN3/FB_IN) R51.1
FB_IN_P: C72.1 IC9.62(*IN3/*FB_IN) R51.2
FB_OUT_N: C75.2 IC9.59(OUT9)
FB_OUT_P: C72.2 IC9.58(*OUT9)
IN0_N: C79.1 IC9.64(*IN0) R52.1
IN0_P: C77.1 IC9.63(IN0) R52.2
IN1_N: C74.1 IC9.2(*IN1) R50.1
IN1_P: C71.1 IC9.1(IN1) R50.2
PLL_IN_AUX_N: C74.2 J9.1
PLL_IN_AUX_P: C71.2 J7.1
PLL_Lock: IC9.47(*LOL) R58.1 TP9.1(TP) ; port Lock
PLL_OUT_N: C70.1 IC9.53(*OUT8)
PLL_OUT_P: C69.1 IC9.54(OUT8)
PLL_OUTA_N: C76.1 IC9.50(*OUT7)
PLL_OUTA_P: C73.1 IC9.51(OUT7)
PLL_SMA_OUT_N: C76.2 J10.1
PLL_SMA_OUT_P: C73.2 J8.1
RSTb: IC9.6(*RST) ; port RSTb  [project net PLL_RSTb]
RXUSRCLK_N: C79.2 ; port CLK_IN_N
RXUSRCLK_P: C77.2 ; port CLK_IN_P
XTAL_GND: IC9.7(XGND) IC9.10(XGND) Q9.2(GND) Q9.4(GND)
NetD4_1: D4.1(K) Q10.3(D)
NetD4_2: D4.2(A) R57.1
NetIC9_3: IC9.3(IN_SEL0) W4.2
NetIC9_8: IC9.8(XA) Q9.1(X)
NetIC9_9: IC9.9(XB) Q9.3(X)
NetIC9_16: IC9.16(SCLK) R53.1 R55.2
NetIC9_18: IC9.18(SDA/SDIO) R54.1 R56.2
NetQ10_1: Q10.1(G) R58.2
NetR55_1: R55.1 W5.1
NetR56_1: R56.1 W6.1

Not connected (* = marked no-connect by the designer): IC9 5(RSVD)* 11(*OE)* 12(*INTR)* 14(IN2)* 15(*IN2)* 20(RSVD)* 21(RSVD)* 22(VDDO0)* 23(*OUT0)* 24(OUT0)* 25(FDEC)* 39(I2C_SEL)* 43(VDDO6)* 44(*OUT6)* 45(OUT6)* 48(FINC)* 55(RSVD)* 56(RSVD)*

### Layout directives
differential pair: DDCLK0_N, DDCLK0_P, DDCLK1_N, DDCLK1_P, DDCLK2_N, DDCLK2_P, DDCLK3_N, DDCLK3_P, DDCLK4_N, DDCLK4_P, FB_IN_N, FB_IN_P, FB_OUT_N, FB_OUT_P, IN0_N, IN0_P, IN1_N, IN1_P, PLL_OUT_N, PLL_OUT_P, PLL_OUTA_N, PLL_OUTA_P
net class Back-Drill: DDCLK0_N, DDCLK0_P, DDCLK1_N, DDCLK1_P, DDCLK2_N, DDCLK2_P, DDCLK3_N, DDCLK3_P, DDCLK4_N, DDCLK4_P, IN0_N, IN0_P, IN1_N, IN1_P, PLL_OUT_N, PLL_OUT_P, PLL_OUTA_N, PLL_OUTA_P
net class Match_PLL_C_DFF: DDCLK0_N, DDCLK0_P, DDCLK1_N, DDCLK1_P, DDCLK2_N, DDCLK2_P, DDCLK3_N, DDCLK3_P, DDCLK4_N, DDCLK4_P, PLL_OUT_N, PLL_OUT_P, PLL_OUTA_N, PLL_OUTA_P
net class 50ohm: PLL_IN_AUX_N, PLL_IN_AUX_P, PLL_SMA_OUT_N, PLL_SMA_OUT_P

### Notes on the sheet
- Jitter Cleaner PLL
- ZDM Feedback
- Matched manually
- Jumpered to GND for PLL_IN, to 1V8 for PLL_IN_AUX
- (near IC9) Internal pull-up
- Internal pull-up
- (near IC9) Internal pull-down
- LOL is push-pull
- LOL is not sticky
- (near IC9) I2C Addr: 1101000
- PLL Lock
- 1mA @ 2.5V
- Project/Equipment
- Document
- Designer
- Drawn by
- Check.by
- File
- Last Mod.
- Print Date
- Sheet
- Size
- A3
- of
- Rev

### Library data of the parts
C69-C86 C91 C92 = C0201-100nF-high-density: GRM033R61C104KE14; Vmax: 16V; Value: 100nF
C87-C90 C93-C100 = CC0402_1UF_16V_10%_X5R: GRM153B30J105ME15; Part Description: SMD Multilayer Chip Ceramic Capacitor; Manufacturer: GENERIC; Manufacturer1 Part Number: C1005X5R1C105KT; Voltage: 16V; TC: X5R; Tolerance: ±10%; Part Number: CC0402_1UF_16V_10%_X5R; Component Kind: Standard; Component Type: Standard; Pin Count: 2; Value: 1uF; Status: Preferred; Manufacturer Part Number: CC0402_1UF_16V_10%_X5R; Case: 0402; Mounted: Yes; Socket: No; SMD: Yes; Sense: No; Manufacturer1 Example: TDK; Manufacturer1 ComponentHeight: 0.55mm; HelpURL: \\cern.ch\dfs\Applications\Altium\Datasheets\CC0402_X5R_TDK_C.pdf; Author: CERN DEM JLC; CreateDate: 10/25/2012; LatestRevisionDate: 10/25/2012
C101 C102 = CC0603_10UF_6.3V_20%_X5R: C1608X5R1E106M080AC; Part Description: SMD Multilayer Chip Ceramic Capacitor; Manufacturer: GENERIC; Manufacturer1 Part Number: C0603C106M9PAC; Voltage: 6.3V; TC: X5R; Tolerance: ±20%; Part Number: CC0603_10UF_6.3V_20%_X5R; Component Kind: Standard; Component Type: Standard; Pin Count: 2; Value: 10uF; Status: Preferred; Manufacturer Part Number: CC0603_10uF_6.3V_20%_X5R; Case: 0603; Mounted: Yes; Socket: No; SMD: Yes; Sense: No; Manufacturer1 Example: KEMET; Manufacturer1 ComponentHeight: 0.95mm; HelpURL: \\cern.ch\dfs\Applications\Altium\Datasheets\CC0603_X5R_KEMET.pdf; Author: CERN DEM JLC; CreateDate: 03/12/2007; LatestRevisionDate: 03/12/2007
D4 = APTD1608LVBC_D: LED; Manufacturer_Name: Kingbright; Manufacturer_Part_Number: APTD1608LVBC/D; Datasheet Link: https://componentsearchengine.com/Datasheets/1/APTD1608LVBC_D.pdf; Height: 1.1mm; Mouser Part Number: 604-APTD1608LVBCD; Mouser Price/Stock: https://www.mouser.co.uk/ProductDetail/Kingbright/APTD1608LVBC-D?qs=6oMev5NRZMEfNSg5xIhlKA%3D%3D; Arrow Part Number: APTD1608LVBC/D; Arrow Price/Stock: https://www.arrow.com/en/products/aptd1608lvbcd/kingbright?utm_currency=USD&region=nac
IC9 = SI5345B-D-GM: Integrated Circuit; Manufacturer_Name: Skyworks; Datasheet Link: https://www.mouser.sg/datasheet/2/472/si5345_44_42_d_datasheet-2507675.pdf; Height: 0.9mm; Manufacturer_Part_Number: SI5345B-D-GM; Mouser Part Number: 634-SI5345B-D-GM; Mouser Price/Stock: https://www.mouser.co.uk/ProductDetail/Skyworks-Solutions-Inc/SI5345B-D-GM?qs=p9T7GgSe1IGHqFUKlxUKrA%3D%3D
J7-J10 = SAMTEC_SMA-J-P-H-ST-MT1: Part Description: 50 Ohms SMA Straight Mixed Technology PCB Jack; Manufacturer: SAMTEC; PressFit: No; Sense Comment: assembly limitations; Part Number: SAMTEC_SMA-J-P-H-ST-MT1; Component Kind: Standard; Component Type: Standard; Pin Count: 5; Family: SMA; Mounted: Yes; Socket: No; SMD: Yes; Sense: Yes; Status: Not Recommended; Manufacturer Part Number: SMA-J-P-H-ST-MT1; ComponentHeight: 7.95mm; HelpURL: \\cern.ch\dfs\Applications\Altium\Datasheets\SAMTEC_SMA-J-P-H-ST-MT1.pdf; Author: CERN DEM HF; CreateDate: 5/24/2023; LatestRevisionDate: 5/24/2023
Q9 = XTAL_48MHZ_KYOCERA_CX3225SB48000D0FPJC1: Crystal 4 pins 1=XTAL Control 2=GND3=XTAL 4=GND; Part Description: Tolerance: ±10ppm, Stability: ±15ppm, 8pF, -40°C to +85°C, Surface Mount Crystal; PressFit: No; Bonding: No; Part Number: XTAL_48MHZ_KYOCERA_CX3225SB48000D0FPJC1; Component Kind: Standard; Component Type: Standard; PackageDescription: SMD Crystal Kyocera, 4 Pins, 2.50mm L X 3.20mm W X 0.6mm H; Value: 48MHz; Manufacturer: KYOCERA; Manufacturer Part Number: CX3225SB48000D0FPJC1; Pin Count: 4; Mounted: Yes; Socket: No; SMD: Yes; Sense: No; ComponentHeight: 0.6mm; HelpURL: \\cern.ch\dfs\Applications\Altium\Datasheets\XTAL_KYOCERA_CX3225SB.pdf; Author: CERN DEM JLC; CreateDate: 6/5/2018; LatestRevisionDate: 6/5/2018
Q10 = CSD15380F3: as Q5 on sheet SFP; Datasheet Link: https://www.ti.com/lit/ds/symlink/csd15380f3.pdf?ts=1641221366106&ref_url=https%253A%252F%252Fwww.google.com%252F; Height: 0.35mm; Manufacturer_Part_Number: CSD15380F3; Mouser Part Number: 595-CSD15380F3; Mouser Price/Stock: https://www.mouser.co.uk/ProductDetail/Texas-Instruments/CSD15380F3?qs=zEmsApcVOkXP46xhm0edmA%3D%3D; Arrow Part Number: CSD15380F3; Arrow Price/Stock: https://www.arrow.com/en/products/csd15380f3/texas-instruments?region=nac
R50-R52 = R0201-100ohm-high-density: Resistor; Value: 100Ω
R53 R54 = R0201-100ohm-high-density: Resistor 10k; Value: 100Ω
R55 R56 = R0402_22R_1%_0.0625W_100PPM: Resistor - 1%; Part Description: General Purpose Thick Film Chip Resistor; Manufacturer: GENERIC; Manufacturer1 Part Number: 232270672209L; TC: ±100ppm/°C; PressFit: No; Part Number: R0402_22R_1%_0.0625W_100PPM; Component Kind: Standard; Component Type: Standard; Pin Count: 2; Value: 22; Status: Not Recommended; Power: 0.0625W; Manufacturer Part Number: R0402_22R_1%_0.0625W_100PPM; Case: 0402; Mounted: Yes; Sense: No; Socket: No; SMD: Yes; Manufacturer1 Example: YAGEO PHYCOMP; Manufacturer1 ComponentHeight: 0.4mm; HelpURL: \\cern.ch\dfs\Applications\Altium\Datasheets\R0402_Phycomp_RC0402.pdf; Author: CERN DEM JLC; CreateDate: 12/3/2007; LatestRevisionDate: 10/17/2012
R57 = R0402_750R_1%_0.0625W_100PPM: Resistor - 1%; Part Description: General Purpose Thick Film Chip Resistor; Manufacturer: GENERIC; Manufacturer1 Part Number: 232270677501L; TC: ±100ppm/°C; PressFit: No; Part Number: R0402_750R_1%_0.0625W_100PPM; Component Kind: Standard; Component Type: Standard; Pin Count: 2; Value: 750; Status: Not Recommended; Power: 0.0625W; Manufacturer Part Number: R0402_750R_1%_0.0625W_100PPM; Case: 0402; Mounted: Yes; Sense: No; Socket: No; SMD: Yes; Manufacturer1 Example: YAGEO PHYCOMP; Manufacturer1 ComponentHeight: 0.4mm; HelpURL: \\cern.ch\dfs\Applications\Altium\Datasheets\R0402_Phycomp_RC0402.pdf; Author: CERN DEM JLC; CreateDate: 12/3/2007; LatestRevisionDate: 10/17/2012
R58 = R0402_200K_1%_0.0625W_100PPM: as R33 on sheet SFP; Part Number: R0402_200K_1%_0.0625W_100PPM; Component Kind: Standard; Component Type: Standard; Pin Count: 2; Value: 200k; Status: Not Recommended; Power: 0.0625W; Manufacturer Part Number: R0402_200K_1%_0.0625W_100PPM; Case: 0402; Mounted: Yes; Sense: No; Socket: No; SMD: Yes; Manufacturer1 Example: YAGEO PHYCOMP; Manufacturer1 ComponentHeight: 0.4mm; HelpURL: \\cern.ch\dfs\Applications\Altium\Datasheets\R0402_Phycomp_RC0402.pdf; Author: CERN DEM JLC; CreateDate: 12/3/2007; LatestRevisionDate: 10/17/2012
TP9 = RCU-0C: MF: {'manufacturer': u'TE Connectivity AMP Connectors'}; Package: None; Price: None; Value: *; MP: RCU-0C; Availability: Unavailable
W4 = SAMTEC_HTSW-103-23-L-S: 3 Mini Wire-Wrap Contact Strip Header; Part Description: 3 Contacts, Pitch 2.54mm, Single Row Through Mount Straight Header (Post Lead 5.84mm, Tail Lead 2.92mm, Insulator 2.54mm); Manufacturer: SAMTEC; PressFit: No; Status Comment: High Temperature; Part Number: SAMTEC_HTSW-103-23-L-S; Component Kind: Standard; Component Type: Standard; Pin Count: 3; Family: Header 3; Mounted: Yes; Socket: No; SMD: No; Sense: No; Status: Preferred; Manufacturer Part Number: HTSW-103-23-L-S; ComponentHeight: 8.38mm; HelpURL: \\cern.ch\dfs\Applications\Altium\Datasheets\SAMTEC_HTSW-103-23-L-S.pdf; Author: CERN DEM JLC; CreateDate: 2/22/2018; LatestRevisionDate: 2/22/2018
W5 W6 = SAMTEC_HTSW-102-23-L-S: as W1 on sheet SFP; Part Number: SAMTEC_HTSW-102-23-L-S; Component Kind: Standard; Component Type: Standard; Pin Count: 2; Family: Header 2; Mounted: Yes; Socket: No; SMD: No; Sense: No; Status: Preferred; Manufacturer Part Number: HTSW-102-23-L-S; ComponentHeight: 8.38mm; HelpURL: \\cern.ch\dfs\Applications\Altium\Datasheets\SAMTEC_HTSW-102-23-L-S.pdf; Author: CERN DEM JLC; CreateDate: 2/22/2018; LatestRevisionDate: 2/22/2018
W7 = SAMTEC_HTSW-101-23-L-S: Single Mini Wire-Wrap Contact; Part Description: Single Contact Through Mount Straight Header (Post Lead 5.84mm, Tail Lead 2.92mm, Insulator 2.54mm); Manufacturer: SAMTEC; PressFit: No; Status Comment: High Temperature; Part Number: SAMTEC_HTSW-101-23-L-S; Component Kind: Standard; Component Type: Standard; Pin Count: 1; Family: Header 1; Mounted: Yes; Socket: No; SMD: No; Sense: No; Status: Preferred; Manufacturer Part Number: HTSW-101-23-L-S; ComponentHeight: 8.38mm; HelpURL: \\cern.ch\dfs\Applications\Altium\Datasheets\SAMTEC_HTSW-101-23-L-S.pdf; Author: CERN DEM JLC; CreateDate: 2/22/2018; LatestRevisionDate: 2/22/2018

## Sheet lane.SchDoc: CDR, Fanout, D-FF
size 420 x 297 mm; CheckedBy: E.Orzes F.Martina S.Baron; CompanyName: CERN; DrawnBy: E.Orzes; Organization: CERN; Address1: European Organization for Nuclear Research; Address2: CH-1211 Genève 23 - Switzerland; Revision: 1.0; SheetNumber: 6; SheetTotal: 7; Projet: Phase Stable Link; DivGrp: EP-ESE; Designer: E.Orzes; ModifiedDate: -
Used 4 times, as channels l3, l2, l1, l0. Parts and nets are listed once, with the designators drawn on the sheet.
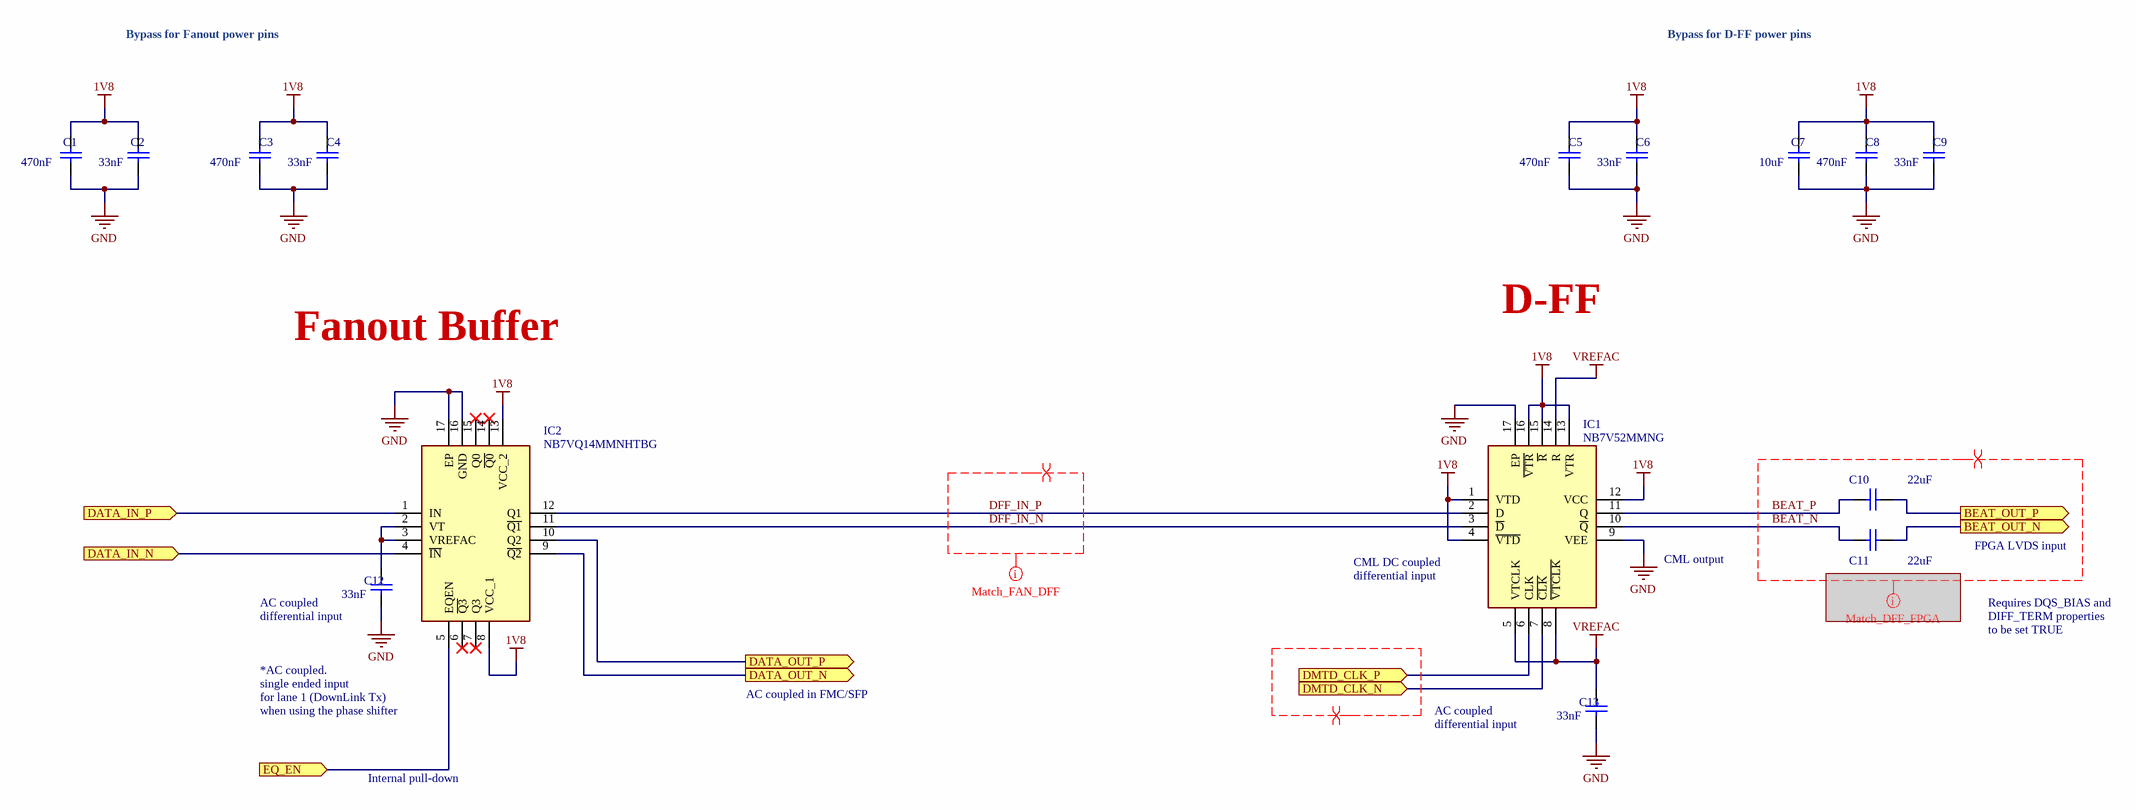
[diagram p3: lane.SchDoc]

### Parts
C1  470nF  [CAPC0510X04N]
C2  33nF  [LLL03TR61E333KE01]
C3  470nF  [CAPC0510X04N]
C4  33nF  [LLL03TR61E333KE01]
C5  470nF  [CAPC0510X04N]
C6  33nF  [LLL03TR61E333KE01]
C7  10uF  [CAPC1608X87N]
C8  470nF  [CAPC0510X04N]
C9  33nF  [LLL03TR61E333KE01]
C10  22uF  [MURATA_HI_DENSITY_0402_CAP]
C11  22uF  [MURATA_HI_DENSITY_0402_CAP]
C12  33nF  [LLL03TR61E333KE01]
C13  33nF  [LLL03TR61E333KE01]
IC1  NB7V52MMNG  [QFN50P300X300X100-17N]
IC2  NB7VQ14MMNHTBG  [QFN50P300X300X100-17N]

### Ports
BEAT_OUT_N (out), BEAT_OUT_P (out), DATA_IN_N (in), DATA_IN_P (in), DATA_OUT_N (out), DATA_OUT_P (out), DMTD_CLK_N (in), DMTD_CLK_P (in), EQ_EN (in)

### Nets
1V8: C1.2 C2.2 C3.2 C4.2 C5.2 C6.2 C7.2 C8.2 C9.2 IC1.1(VTD) IC1.4(~{VTD}) IC1.12(VCC) IC1.13(VTR) IC1.15(~{R}) IC1.16(~{VTR}) IC2.8(VCC_1) IC2.13(VCC_2)
GND: C1.1 C2.1 C3.1 C4.1 C5.1 C6.1 C7.1 C8.1 C9.1 C12.1 C13.1 IC1.9(VEE) IC1.17(EP) IC2.16(GND) IC2.17(EP)
VREFAC: C13.2 IC1.5(VTCLK) IC1.8(~{VTCLK}) IC1.14(R)
BEAT_N: C11.2 IC1.10(~{Q})
BEAT_OUT_N: C11.1 ; port BEAT_OUT_N
BEAT_OUT_P: C10.1 ; port BEAT_OUT_P
BEAT_P: C10.2 IC1.11(Q)
DATA_IN_N: IC2.4(~{IN}) ; port DATA_IN_N
DATA_IN_P: IC2.1(IN) ; port DATA_IN_P
DATA_OUT_N: IC2.9(~{Q2}) ; port DATA_OUT_N
DATA_OUT_P: IC2.10(Q2) ; port DATA_OUT_P
DFF_IN_N: IC1.3(~{D}) IC2.11(~{Q1})
DFF_IN_P: IC1.2(D) IC2.12(Q1)
DMTD_CLK_N: IC1.7(~{CLK}) ; port DMTD_CLK_N
DMTD_CLK_P: IC1.6(CLK) ; port DMTD_CLK_P
EQ_EN: IC2.5(EQEN) ; port EQ_EN
NetC12_2: C12.2 IC2.2(VT) IC2.3(VREFAC)

Not connected (* = marked no-connect by the designer): IC2 6(~{Q3})* 7(Q3)* 14(~{Q0})* 15(Q0)*

### Channels
l3: designators end in _l3; ports BEAT_OUT_N=BEAT_3_N BEAT_OUT_P=BEAT_3_P DATA_IN_N=FPGA_TX0_C_N DATA_IN_P=FPGA_TX0_C_P DATA_OUT_N=SFP_TX0_N DATA_OUT_P=SFP_TX0_P DMTD_CLK_N=DMTD_CLK_3_N DMTD_CLK_P=DMTD_CLK_3_P EQ_EN=EQ3_EN
l2: designators end in _l2; ports BEAT_OUT_N=BEAT_2_N BEAT_OUT_P=BEAT_2_P DATA_IN_N=SFP_RX1_N DATA_IN_P=SFP_RX1_P DATA_OUT_N=FPGA_RX1_N DATA_OUT_P=FPGA_RX1_P DMTD_CLK_N=DMTD_CLK_2_N DMTD_CLK_P=DMTD_CLK_2_P EQ_EN=EQ2_EN
l1: designators end in _l1; ports BEAT_OUT_N=BEAT_1_N BEAT_OUT_P=BEAT_1_P DATA_IN_N=FPGA_TX1_PS_N DATA_IN_P=FPGA_TX1_PS_P DATA_OUT_N=SFP_TX1_N DATA_OUT_P=SFP_TX1_P DMTD_CLK_N=DMTD_CLK_1_N DMTD_CLK_P=DMTD_CLK_1_P EQ_EN=EQ1_EN
l0: designators end in _l0; ports BEAT_OUT_N=BEAT_0_N BEAT_OUT_P=BEAT_0_P DATA_IN_N=SFP_RX0_N DATA_IN_P=SFP_RX0_P DATA_OUT_N=FPGA_RX0_N DATA_OUT_P=FPGA_RX0_P DMTD_CLK_N=DMTD_CLK_0_N DMTD_CLK_P=DMTD_CLK_0_P EQ_EN=EQ0_EN

### Layout directives
differential pair: (no net found under the mark), BEAT_N, BEAT_P, DFF_IN_N, DFF_IN_P
net class Match_FAN_DFF: DFF_IN_N, DFF_IN_P
net class Match_DFF_FPGA: BEAT_N, BEAT_P

### Notes on the sheet
- Bypass for Fanout power pins
- Bypass for D-FF power pins
- D-FF
- Fanout Buffer
- (near IC1) CML DC coupled
  differential input
- CML output
- FPGA LVDS input
- (near C12) AC coupled
  differential input
- Requires DQS_BIAS and DIFF_TERM properties to be set TRUE
- *AC coupled.
  single ended input
  for lane 1 (DownLink Tx) when using the phase shifter
- AC coupled in FMC/SFP
- AC coupled
  differential input
- Internal pull-down
- Project/Equipment
- Document
- Designer
- Drawn by
- Check.by
- File
- Last Mod.
- Print Date
- Sheet
- Size
- A3
- of
- Rev

### Library data of the parts
C1 C3 C5 C8 = Capacitor - non polarized: LLL153C70G474ME17; Value: 470nF
C2 C4 C6 C9 C12 C13 = Capacitor - non polarized: LLL03TR61E333KE01; Value: 33nF
C7 = CC0603_10UF_6.3V_20%_X5R: as C101 on sheet PLL; Part Number: CC0603_10UF_6.3V_20%_X5R; Component Kind: Standard; Component Type: Standard; Pin Count: 2; Value: 10uF; Status: Preferred; Manufacturer Part Number: CC0603_10uF_6.3V_20%_X5R; Case: 0603; Mounted: Yes; Socket: No; SMD: Yes; Sense: No; Manufacturer1 Example: KEMET; Manufacturer1 ComponentHeight: 0.95mm; HelpURL: \\cern.ch\dfs\Applications\Altium\Datasheets\CC0603_X5R_KEMET.pdf; Author: CERN DEM JLC; CreateDate: 03/12/2007; LatestRevisionDate: 03/12/2007
C10 C11 = C0402-22uF-high-density: GRM155R60J226ME11; Vmax: 6.3V; Value: 22uF
IC1 = NB7V52MMNG: Integrated Circuit; Manufacturer_Name: onsemi; Datasheet Link: https://www.onsemi.com/pdf/datasheet/nb7v52m-d.pdf; Height: 1mm; Manufacturer_Part_Number: NB7V52MMNG; Mouser Part Number: 863-NB7V52MMNG; Mouser Price/Stock: https://www.mouser.co.uk/ProductDetail/ON-Semiconductor/NB7V52MMNG?qs=N5dOQkml4H8i91m%252BmwlaUQ%3D%3D; Arrow Part Number: NB7V52MMNG; Arrow Price/Stock: https://www.arrow.com/en/products/nb7v52mmng/on-semiconductor
IC2 = NB7VQ14MMNHTBG: Integrated Circuit; Manufacturer_Name: onsemi; Datasheet Link: http://www.onsemi.com/pub/Collateral/NB7VQ14M-D.PDF; Height: 1mm; Manufacturer_Part_Number: NB7VQ14MMNHTBG; Mouser Part Number: 863-NB7VQ14MMNHTBG; Mouser Price/Stock: https://www.mouser.co.uk/ProductDetail/onsemi/NB7VQ14MMNHTBG?qs=3PKVEWFFm2%2FWq%2FFZ4xstfg%3D%3D; Arrow Part Number: NB7VQ14MMNHTBG; Arrow Price/Stock: https://www.arrow.com/en/products/nb7vq14mmnhtbg/on-semiconductor?utm_currency=USD&region=nac